# Altium schematic sheet MC.SchDoc
size A4; SheetNumber: 1; SheetTotal: 3
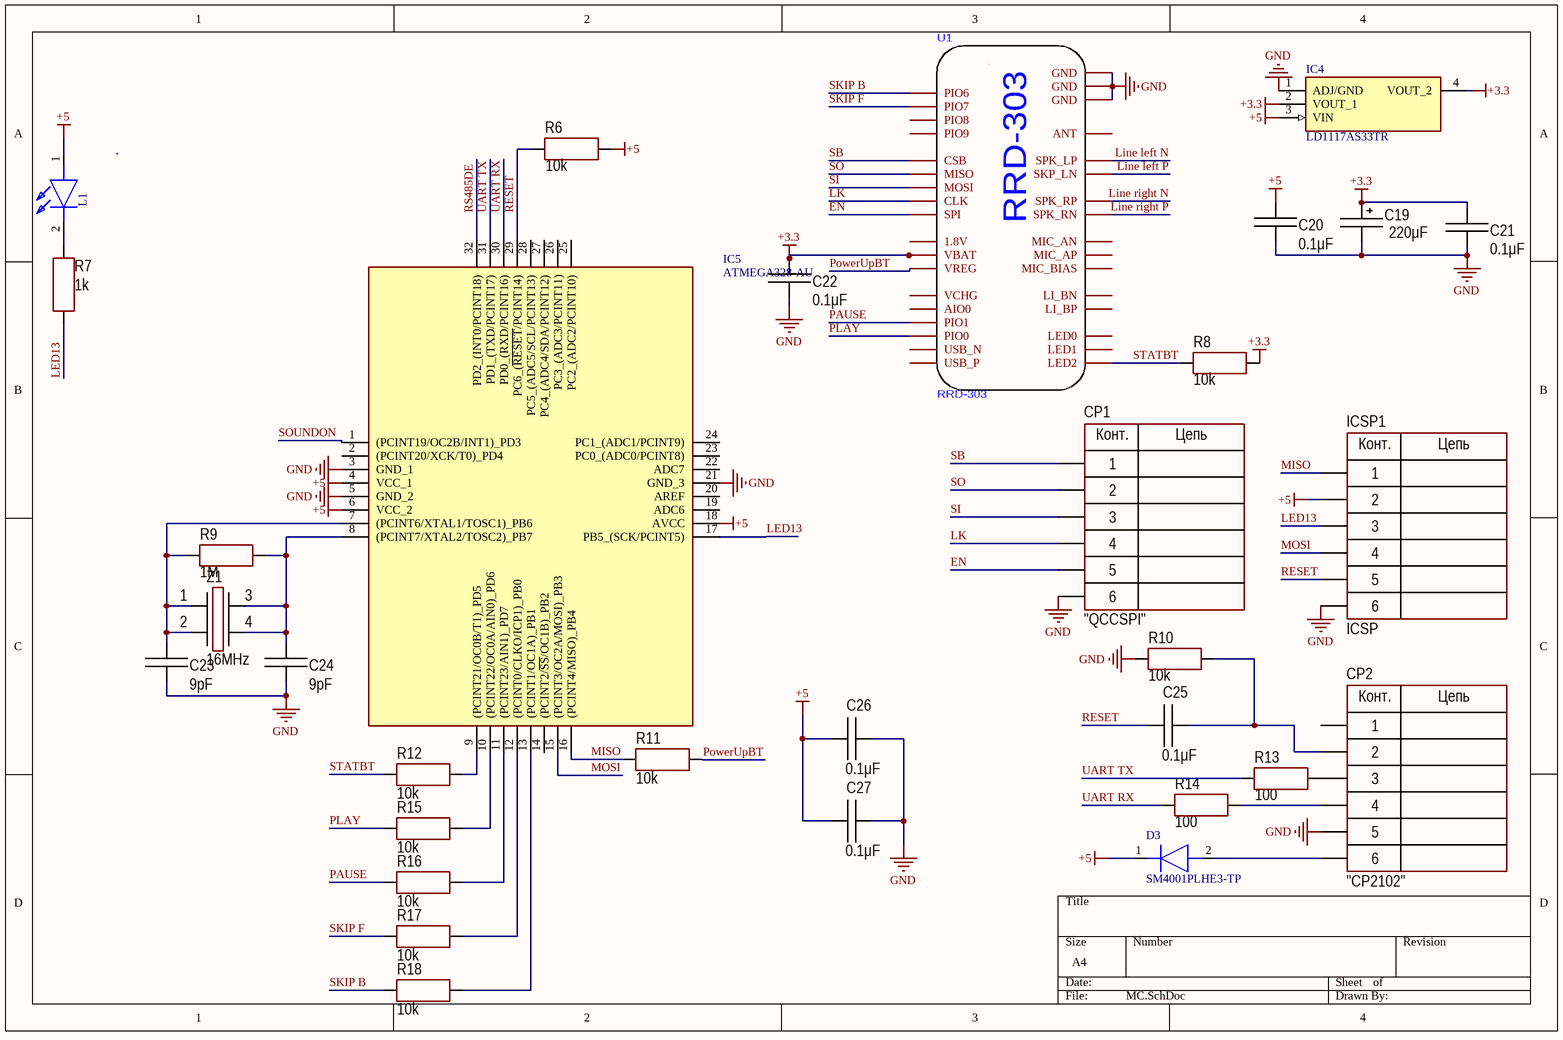
[diagram p0: MC.SchDoc]

## Parts
C19  value 220μF  [CAP: D10C5H20]
C20  value 0.1μF  [CAP: 0805]
C21  value 0.1μF  [CAP: 0805]
C22  value 0.1μF  [CAP: 0805]
C23  value 9pF  [CAP: 0805]
C24  value 9pF  [CAP: 0805]
C25  value 0.1μF  [CAP: 0805]
C26  value 0.1μF  [CAP: 0805]
C27  value 0.1μF  [CAP: 0805]
CP1  CommentText: "QCCSPI"  [CON: PLS-6]
CP2  CommentText: "CP2102"  [CON: PLS-6]
D3  SM4001PLHE3-TP  [SODFL3616X135N]
IC4  LD1117AS33TR  [SOT230P700X190-4N]
IC5  ATMEGA328-AU  [QFP80P900X900X120-32N]
ICSP1  CommentText: ICSP  [CON: PBD-6]
L1  KP2012SGC  [KP2012SGC]  (value not drawn)
R6  value 10k  [RES: 0805]
R7  value 1k  [RES: 0805]
R8  value 10k  [RES: 0805]
R9  value 1M  [RES: 0805]
R10  value 10k  [RES: 0805]
R11  value 10k  [RES: 0805]
R12  value 10k  [RES: 0805]
R13  value 100  [RES: 0805]
R14  value 100  [RES: 0805]
R15  value 10k  [RES: 0805]
R16  value 10k  [RES: 0805]
R17  value 10k  [RES: 0805]
R18  value 10k  [RES: 0805]
U1  RRD-303  [RRD-303]
Z1  Frequency: 16MHz  [OSC: 2520]

## Nets
+3.3: C19.1 C21.1 C22.1 IC4.2(VOUT_1) IC4.4(VOUT_2) R8.2 U1.12(VBAT)
+5: C20.1 C26.2 C27.2 D3.1(K) IC4.3(VIN) IC5.4(VCC_1) IC5.6(VCC_2) IC5.18(AVCC) ICSP1.2 L1.1(A) R6.2
GND: C19.2 C20.2 C21.2 C22.2 C23.2 C24.2 C26.1 C27.1 CP1.6 CP2.5 IC4.1(ADJ/GND) IC5.3(GND_1) IC5.5(GND_2) IC5.21(GND_3) ICSP1.6 R10.1 U1.1(GND) U1.15(GND) U1.27(GND)
EN: CP1.5 U1.10(SPI)
LED13: IC5.17(PB5_(SCK/PCINT5)) ICSP1.3 R7.1
Line left N: U1.16(SPK_LP)
Line left P: U1.17(SKP_LN)
Line right N: U1.18(SPK_RP)
Line right P: U1.19(SPK_RN)
LK: CP1.4 U1.9(CLK)
MISO: IC5.16((PCINT4/MISO)_PB4) ICSP1.1 R11.1
MOSI: IC5.15((PCINT3/OC2A/MOSI)_PB3) ICSP1.4
PAUSE: R16.1 U1.30(PIO1)
PLAY: R15.1 U1.31(PIO0)
PowerUpBT: R11.2 U1.13(VREG)
RESET: C25.2 IC5.29(PC6_(~{RESET}/PCINT14)) ICSP1.5 R6.1
RS485DE: IC5.32(PD2_(INT0/PCINT18))
SB: CP1.1 U1.6(CSB)
SI: CP1.3 U1.8(MOSI)
SKIP B: R18.1 U1.2(PIO6)
SKIP F: R17.1 U1.3(PIO7)
SO: CP1.2 U1.7(MISO)
SOUNDON: IC5.1((PCINT19/OC2B/INT1)_PD3)
STATBT: R8.1 R12.1 U1.34(LED2)
UART RX: IC5.30(PD0_(RXD/PCINT16)) R14.1
UART TX: IC5.31(PD1_(TXD/PCINT17)) R13.1
NetC23_1: C23.1 IC5.7((PCINT6/XTAL1/TOSC1)_PB6) R9.1 Z1.1 Z1.2
NetC24_1: C24.1 IC5.8((PCINT7/XTAL2/TOSC2)_PB7) R9.2 Z1.3 Z1.4
NetC25_1: C25.1 CP2.2 R10.2
NetCP2_3: CP2.3 R13.2
NetCP2_4: CP2.4 R14.2
NetCP2_6: CP2.6 D3.2(A)
NetIC5_9: IC5.9((PCINT21/OC0B/T1)_PD5) R12.2
NetIC5_10: IC5.10((PCINT22/OC0A/AIN0)_PD6) R15.2
NetIC5_11: IC5.11((PCINT23/AIN1)_PD7) R16.2
NetIC5_12: IC5.12((PCINT0/CLKO/ICP1)_PB0) R17.2
NetIC5_13: IC5.13((PCINT1/OC1A)_PB1) R18.2
NetL1_2: L1.2(K) R7.2

Not connected (* = marked no-connect by the designer): CP2 1; IC5 2((PCINT20/XCK/T0)_PD4) 14((PCINT2/~{SS}/OC1B)_PB2) 19(ADC6) 20(AREF) 22(ADC7) 23(PC0_(ADC0/PCINT8)) 24(PC1_(ADC1/PCINT9)) 25(PC2_(ADC2/PCINT10)) 26(PC3_(ADC3/PCINT11)) 27(PC4_(ADC4/SDA/PCINT12)) 28(PC5_(ADC5/SCL/PCINT13)); U1 4(PIO8) 5(PIO9) 11(1.8V) 14(ANT) 20(MIC_AN) 21(MIC_AP) 22(MIC_BIAS) 23(LI_BN) 24(LI_BP) 25(LED0) 26(LED1) 28(VCHG) 29(AIO0) 32(USB_N) 33(USB_P)

## Notes on the sheet
- (in symbol PBD-6) Конт.; Цепь
- (in symbol PLS-6) Конт.; Цепь

## Library data of the parts
C19 = Aluminium: Manufacturer: Wurth; PartNumber: 860080475013; ValueManufacturerPartNumber: Aluminium capacitor, 220μF, 25V, ±20%, 54mOhm, 14x10x5 mm, -55...+105°C; TypeCapacitor: Aluminium capacitor; Tolerance: ±20%; Impedance: 54mOhm; Voltage: 25V; Package: 14x10x5 mm; HelpURL: https://www.digikey.com/product-detail/en/wurth-electronics-inc/860080475013/732-9029-1-ND/5728972; Temperature: -55...+105°C
C20-C27 = Ceramic_0805: Manufacturer: Yageo; PartNumber: CC0805KRX7R7BB104; TypeCapacitor: Ceramic capacitor; Tolerance: ±10%; TypeDielectric: X7R; Package: 0805; HelpURL: https://www.digikey.com/product-detail/en/yageo/CC0805KRX7R7BB104/311-1142-1-ND/303052; ValueManufacturerPartNumber: =TypeCapacitor+', '+Value+', '+TypeDielectric+', '+Tolerance+', '+Voltage+', '+Package+', '+Temperature; Temperature: -55...+125°C
CP1 CP2 = PLS-6: Manufacturer: Connfly; ValueManufacturerPartNumber: Connector, 6pin, 2.54mm, 500VAC, 3A; TypeConnector: Connector; VoltageMax: 500VAC; Pitch: 2.54mm; CurrentMax: 3A; Multichannel: 6pin; HelpURL: https://www.chipdip.ru/product/pls-6; PartNumber: PLS-6
D3 = SM4001PLHE3-TP: Diode; Manufacturer_Name: MCC; Datasheet Link: https://www.mccsemi.com/pdf/Products/SM4001PLHE3-SM4007PLHE3(SOD-123FL).pdf; Height: 1.35mm; Manufacturer_Part_Number: SM4001PLHE3-TP; Mouser Part Number: 833-SM4001PLHE3-TP; Mouser Price/Stock: https://www.mouser.co.uk/ProductDetail/Micro-Commercial-Components-MCC/SM4001PLHE3-TP?qs=QNEnbhJQKvZveZWFAoodWg%3D%3D; Arrow Part Number: SM4001PLHE3-TP; Arrow Price/Stock: https://www.arrow.com/en/products/sm4001plhe3-tp/micro-commercial-components?region=nac
IC4 = LD1117AS33TR: Power Supply; Manufacturer_Name: STMicroelectronics; Datasheet Link: https://4donline.ihs.com/images/VipMasterIC/IC/SGST/SGSTS49356/SGSTS49356-1.pdf?hkey=6D3A4C79FDBF58556ACFDE234799DDF0; Height: 1.9mm; Manufacturer_Part_Number: LD1117AS33TR; Mouser Part Number: 511-LD1117AS33; Mouser Price/Stock: https://www.mouser.co.uk/ProductDetail/STMicroelectronics/LD1117AS33TR?qs=C3bf%2FVrkE5CoDDd7wyn%252BaQ%3D%3D; Arrow Part Number: LD1117AS33TR; Arrow Price/Stock: https://www.arrow.com/en/products/ld1117as33tr/stmicroelectronics?region=europe
IC5 = ATMEGA328-AU: Integrated Circuit; Manufacturer_Name: Microchip; Datasheet Link: https://ww1.microchip.com/downloads/en/DeviceDoc/ATmega48A-PA-88A-PA-168A-PA-328-P-DS-DS40002061B.pdf; Height: 1.2mm; Manufacturer_Part_Number: ATMEGA328-AU; Mouser Part Number: 556-ATMEGA328-AU; Mouser Price/Stock: https://www.mouser.co.uk/ProductDetail/Microchip-Technology/ATMEGA328-AU?qs=lwdSMh1%2FoYJRHuGBjWz9Pg%3D%3D; Arrow Part Number: ATMEGA328-AU; Arrow Price/Stock: https://www.arrow.com/en/products/atmega328-au/microchip-technology?region=europe
ICSP1 = PBD-6: Manufacturer: Connfly; ValueManufacturerPartNumber: Connector, 6pin, 2.54mm, 500VAC, 3A; TypeConnector: Connector; VoltageMax: 500VAC; Pitch: 2.54mm; CurrentMax: 3A; Multichannel: 6pin; HelpURL: https://www.chipdip.ru/product/pbd-6; PartNumber: PBD-6
L1 = KP2012SGC: LED; Manufacturer_Name: Kingbright; Datasheet Link: https://docs.rs-online.com/9e3e/0900766b8032fa8b.pdf; Height: 1.1mm; Manufacturer_Part_Number: KP2012SGC; Mouser Part Number: N/A; Mouser Price/Stock: https://www.mouser.co.uk/ProductDetail/Kingbright/KP2012SGC?qs=5aG0NVq1C4xgkmzx8ebWbQ%3D%3D
R6 R8 R10-R12 R15-R18 = Resistor_0805: Manufacturer: Yageo; PartNumber: RC0805JR-07100RL; ValueManufacturerPartNumber: Resistor film, 10k, ±5%, 0805, 0.125W, -55...+125°C; TypeResistor: Resistor film; Power: 0.125W; Tolerance: ±5%; Package: 0805; HelpURL: https://www.digikey.com/product-detail/en/yageo/RC0805JR-07100RL/311-100ARCT-ND/731185; Temperature: -55...+125°C
R7 = Resistor_0805: Manufacturer: Yageo; PartNumber: RC0805JR-07100RL; ValueManufacturerPartNumber: Resistor film, 1k, ±5%, 0805, 0.125W, -55...+125°C; TypeResistor: Resistor film; Power: 0.125W; Tolerance: ±5%; Package: 0805; HelpURL: https://www.digikey.com/product-detail/en/yageo/RC0805JR-07100RL/311-100ARCT-ND/731185; Temperature: -55...+125°C
R9 = Resistor_0805: Manufacturer: Yageo; PartNumber: RC0805JR-07100RL; ValueManufacturerPartNumber: Resistor film, 1M, ±5%, 0805, 0.125W, -55...+125°C; TypeResistor: Resistor film; Power: 0.125W; Tolerance: ±5%; Package: 0805; HelpURL: https://www.digikey.com/product-detail/en/yageo/RC0805JR-07100RL/311-100ARCT-ND/731185; Temperature: -55...+125°C
R13 R14 = Resistor_0805: Manufacturer: Yageo; PartNumber: RC0805JR-07100RL; ValueManufacturerPartNumber: Resistor film, 100, ±5%, 0805, 0.125W, -55...+125°C; TypeResistor: Resistor film; Power: 0.125W; Tolerance: ±5%; Package: 0805; HelpURL: https://www.digikey.com/product-detail/en/yageo/RC0805JR-07100RL/311-100ARCT-ND/731185; Temperature: -55...+125°C
Z1 = Crystal_2520: Manufacturer: Epson; PartNumber: FA-20H 16.0000MF20X-B; ValueManufacturerPartNumber: Crystal, 16MHz, 16pF, ±20ppm, case 2520, -40...+85°C; LoadCapacitance: 16pF; Tolerance: ±20ppm; Package: case 2520; HelpURL: https://www.digikey.com/product-detail/en/epson/FA-20H-16.0000MF20X-B/SER4202-ND/7430937; Temperature: -40...+85°C; TypeOscilator: Crystal